# Altium project CAN_CurrentLoopModule.PrjPcb
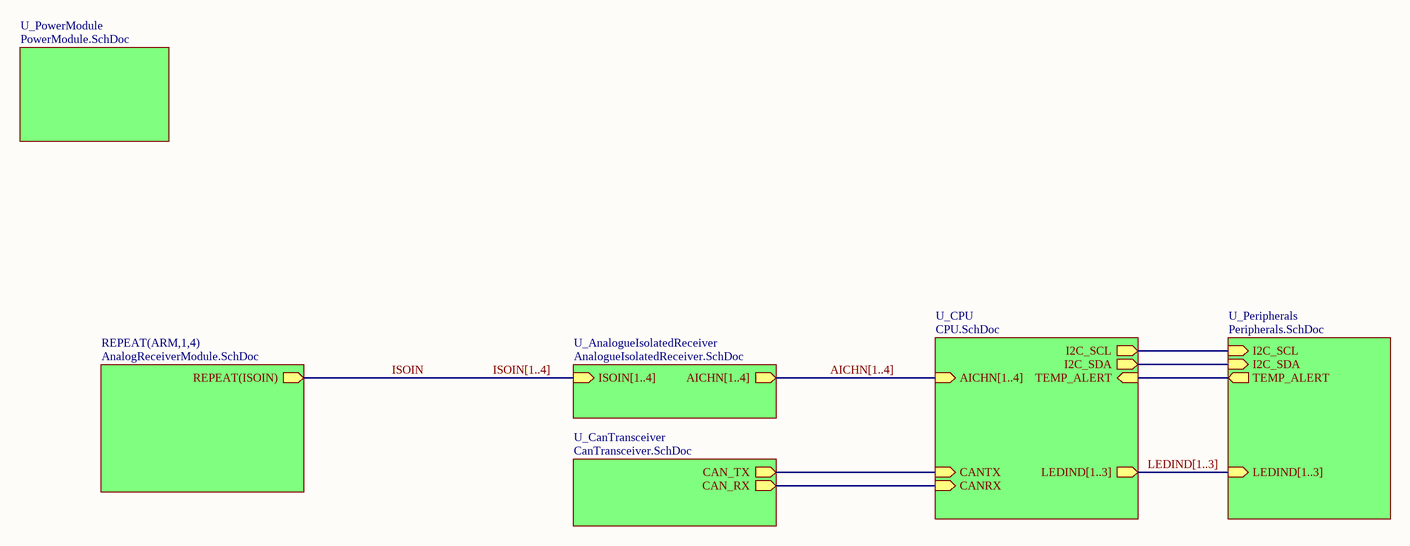
[diagram p0: TopSheet.SchDoc]
Address_Website: pablintino.com; EMail: me@pablintino.com; Project: AIC-ISO-C Module; VersionRevision: 1
7 sheets, 180 parts. Net scope: hierarchical (ports join the sheet entries above them; power ports are global).
Board file: AnalogIO-CAN-HW-Rev1.PcbDoc
Sheets:
  TopSheet.SchDoc
    U_PowerModule = PowerModule.SchDoc
    U_AnalogueIsolatedReceiver = AnalogueIsolatedReceiver.SchDoc
    U_CanTransceiver = CanTransceiver.SchDoc
    U_CPU = CPU.SchDoc
    U_Peripherals = Peripherals.SchDoc
    ARM1 = AnalogReceiverModule.SchDoc
    ARM2 = AnalogReceiverModule.SchDoc
    ARM3 = AnalogReceiverModule.SchDoc
    ARM4 = AnalogReceiverModule.SchDoc

## Sheet TopSheet.SchDoc
size A4

### Sub-sheets
REPEAT(ARM,1,4) = AnalogReceiverModule.SchDoc: REPEAT(ISOIN) (out)
U_AnalogueIsolatedReceiver = AnalogueIsolatedReceiver.SchDoc: ISOIN[1..4] (in), AICHN[1..4] (out)
U_CanTransceiver = CanTransceiver.SchDoc: CAN_RX (out), CAN_TX (out)
U_CPU = CPU.SchDoc: CANTX (in), CANRX (in), AICHN[1..4] (in), I2C_SCL (out), I2C_SDA (out), TEMP_ALERT (in), LEDIND[1..3] (out)
U_Peripherals = Peripherals.SchDoc: I2C_SCL (in), TEMP_ALERT (out), I2C_SDA (in), LEDIND[1..3] (in)
U_PowerModule = PowerModule.SchDoc: no entries

### Nets
I2C_SCL: sheet U_CPU/I2C_SCL, sheet U_Peripherals/I2C_SCL
I2C_SDA: sheet U_CPU/I2C_SDA, sheet U_Peripherals/I2C_SDA
ISOIN: sheet REPEAT(ARM,1,4)/REPEAT(ISOIN)
NetR33_2: sheet U_CPU/TEMP_ALERT, sheet U_Peripherals/TEMP_ALERT
NetU4_21: sheet U_CanTransceiver/CAN_RX, sheet U_CPU/CANRX
NetU4_22: sheet U_CanTransceiver/CAN_TX, sheet U_CPU/CANTX

### Buses and harness runs
bus AICHN[1..4] = sheet U_AnalogueIsolatedReceiver/AICHN[1..4] = sheet U_CPU/AICHN[1..4]
bus ISOIN[1..4] = sheet U_AnalogueIsolatedReceiver/ISOIN[1..4]
bus LEDIND[1..3] = sheet U_CPU/LEDIND[1..3] = sheet U_Peripherals/LEDIND[1..3]

### Notes on the sheet
- Title:
- Drawn By:
- Page Contents:
- Checked By:
- Size:
- Date:
- File:
- License:
- Email:
- A4
- Number:
- Time:
- Revision:
- Sheet
- Website:
- of

## Sheet PowerModule.SchDoc: CAN Current Loop Module - Power
size A4; Author: Pablo R Nava; DrawnBy: Pablo R Nava; Engineer: Pablo R Nava
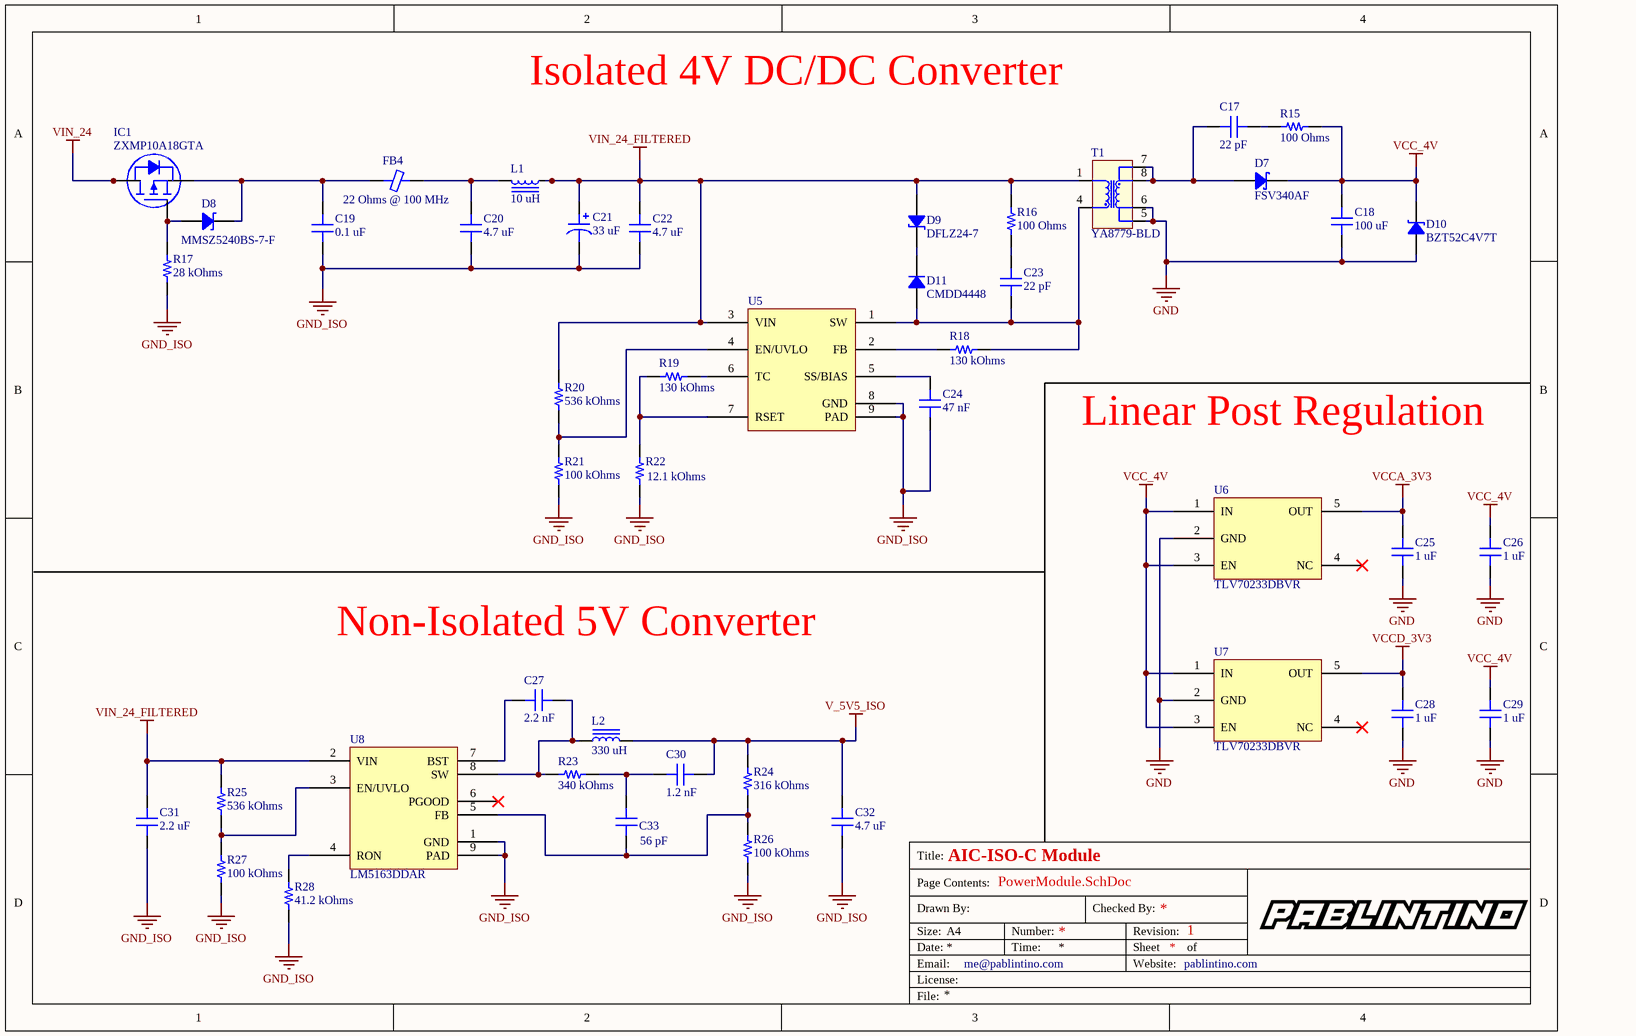
[diagram p1: PowerModule.SchDoc]

### Parts
(Parts that share a designator on the sheet are numbered #1, #2 ... from top to bottom, then left to right.)
C17#1  22 pF  [CAP 0805_2012]
C18  100 uF  [CAP 1210_3225 - 2.5MM]
C19  0.1 uF  [CAP 0805_2012]
C20  4.7 uF  [CAP 1210_3225 - 2.0MM]
C21  33 uF  [CAP ALSMD POLY 10.3MM H10.2MM]
C22  4.7 uF  [CAP 1210_3225 - 2.0MM]
C23  22 pF  [CAP 0805_2012]
C24  47 nF  [CAP 0805_2012]
C25  1 uF  [CAP 0805_2012]
C26  1 uF  [CAP 0805_2012]
C27  2.2 nF  [CAP 0805_2012]
C28  1 uF  [CAP 0805_2012]
C29  1 uF  [CAP 0805_2012]
C30  1.2 nF  [CAP 0805_2012]
C31  2.2 uF  [CAP 1210_3225 - 2.5MM]
C32  4.7 uF  [CAP 1210_3225 - 2.0MM]
C33  56 pF  [CAP 0805_2012]
D7  FSV340AF  [ON DO214AD SMAF]
D8  MMSZ5240BS-7-F  [SOD-123]
D9  DFLZ24-7  [POWERDI123]
D10  BZT52C4V7T  [SOD-523]
D11  CMDD4448  [SOD323]
FB4  22 Ohms @ 100 MHz  [FER 0805_2012]
IC1  ZXMP10A18GTA  [DIODES SOT-223]
L1  10 uH  [WE-TPC_4818]
L2  330 uH  [BOURNS SRR1280]
R15  100 Ohms  [RES 0805_2012]
R16  100 Ohms  [RES 0805_2012]
R17  28 kOhms  [RES 0805_2012]
R18  130 kOhms  [RES 0805_2012]
R19  130 kOhms  [RES 0805_2012]
R20  536 kOhms  [RES 0805_2012]
R21  100 kOhms  [RES 0805_2012]
R22  12.1 kOhms  [RES 0805_2012]
R23  340 kOhms  [RES 0805_2012]
R24  316 kOhms  [RES 0805_2012]
R25  536 kOhms  [RES 0805_2012]
R26  100 kOhms  [RES 0805_2012]
R27  100 kOhms  [RES 0805_2012]
R28  41.2 kOhms  [RES 0805_2012]
T1  YA8779-BLD  [YA8779]
U5  LM5180QNGURQ1  [TI WSON-8 NGU]  (value not drawn)
U6  TLV70233DBVR  [TI SOT-23-5 DBV]
U7  TLV70233DBVR  [TI SOT-23-5 DBV]
U8  LM5163DDAR  [SOIC_DDAR_TEX]

### Nets
GND: C18.2 C25.2 C26.2 C28.2 C29.2 D10.1 T1.5 T1.6 U6.2(GND) U7.2(GND)
GND_ISO: C19.2 C20.1 C21.2 C22.1 C24.1 C31.1 C32.1 R17.1 R21.1 R22.2 R26.2 R27.1 R28.2 U5.8(GND) U5.9(PAD) U8.1(GND) U8.9(PAD)
V_5V5_ISO: C30.1 C32.2 L2.2 R24.1
VCC_4V: C18.1 C26.1 C29.1 D7.2 D10.2 R15.1 U6.1(IN) U6.3(EN) U7.1(IN) U7.3(EN)
VCCA_3V3: C25.1 U6.5(OUT)
VCCD_3V3: C28.1 U7.5(OUT)
VIN_24: IC1.2(D) IC1.4(D)
VIN_24_FILTERED: C21.1 C22.2 C31.2 D9.1 L1.1 R16.2 R20.1 R25.1 T1.1 U5.3(VIN) U8.2(VIN)
NetC17#1_1: C17#1.1 D7.1 T1.7 T1.8
NetC17#1_2: C17#1.2 R15.2
NetC19_1: C19.1 D8.2 FB4.2 IC1.3(S)
NetC20_2: C20.2 FB4.1 L1.2
NetC23_1: C23.1 R16.1
NetC23_2: C23.2 D11.1 R18.1 T1.4 U5.1(SW)
NetC24_2: C24.2 U5.5(SS/BIAS)
NetC27_1: C27.1 L2.1 R23.2 U8.8(SW)
NetC27_2: C27.2 U8.7(BST)
NetC30_2: C30.2 C33.2 R23.1
NetC33_1: C33.1 R24.2 R26.1 U8.5(FB)
NetD8_1: D8.1 IC1.1(G) R17.2
NetD9_2: D9.2 D11.2
NetR18_2: R18.2 U5.2(FB)
NetR19_1: R19.1 U5.6(TC)
NetR19_2: R19.2 R22.1 U5.7(RSET)
NetR20_2: R20.2 R21.2 U5.4(EN/UVLO)
NetR25_2: R25.2 R27.2 U8.3(EN/UVLO)
NetR28_1: R28.1 U8.4(RON)

Not connected (* = marked no-connect by the designer): U6 4(NC)*; U7 4(NC)*; U8 6(PGOOD)*

### Notes on the sheet
- Isolated 4V DC/DC Converter
- Linear Post Regulation
- Non-Isolated 5V Converter
- Title:
- Drawn By:
- Page Contents:
- Checked By:
- Size:
- Date:
- File:
- License:
- Email:
- A4
- Number:
- Time:
- Revision:
- Sheet
- Website:
- of

### Library data of the parts
C17#1 C23 = 08051C220JAT2A: MLCC Ceramic 22 pF 100 V 5% Capacitor; Manufacturer: AVX; Voltage: 100 V; Type: capacitor_ceramic; Through Hole: 0; Part Number: 08051C220JAT2A; Value: 22 pF; Tolerance: 5%; Composition: X7R; Created On: 03/07/2020 16:35:00; Updated On: 03/07/2020 16:36:02; Package: 0805 (2012 Metric)
C18 = JMK325AC7107MM-P: MLCC Ceramic 100 uF 6.3 V 20% Capacitor; Manufacturer: Taiyo Yuden; Voltage: 6.3 V; Type: capacitor_ceramic; Through Hole: 0; Part Number: JMK325AC7107MM-P; Value: 100 uF; Tolerance: 20%; Composition: X7S; Created On: 03/07/2020 19:44:15; Updated On: 03/07/2020 19:44:30; Package: 1210 (3225 Metric)
C19 = 08051C104J4T4A: MLCC Ceramic 0.1 uF 100 V 10% Capacitor; Manufacturer: AVX; Voltage: 100 V; Type: capacitor_ceramic; Through Hole: 0; Part Number: 08051C104J4T4A; Value: 0.1 uF; Tolerance: 10%; Composition: X7R; Created On: 10/07/2020 23:21:56; Updated On: 10/07/2020 23:22:31; Package: 0805 (2012 Metric)
C20 C22 C32 = C3225X7S2A475M200AB: MLCC Ceramic 4.7 uF 100 V 20% Capacitor; Manufacturer: TDK; Voltage: 100 V; Type: capacitor_ceramic; Through Hole: 0; Part Number: C3225X7S2A475M200AB; Value: 4.7 uF; Tolerance: 20%; Composition: X7S; Created On: 10/07/2020 20:19:29; Updated On: 10/07/2020 20:19:45; Package: 1210 (3225 Metric)
C21 = EEEFK2A330P: Aluminum Electrolytic 33 uF 100 V 20% Capacitor; Manufacturer: Panasonic; Voltage: 100 V; Material: aluminium; Polarised: 1; ESR: 700 mOhms; Lifetime Temperature: 2000 Hours @ 105 ºC; Minimum Temperature: 105 ºC; Maximum Temperature: -55 ºC; Type: capacitor_electrolytic; Through Hole: 0; Part Number: EEEFK2A330P; Value: 33 uF; Tolerance: 20%; Created On: 08/07/2020 20:44:47; Updated On: 08/07/2020 21:47:25; Package: SMD
C24 = C2012X7R2A473K125AA: MLCC Ceramic 47 nF 100 V 10% Capacitor; Manufacturer: TDK; Voltage: 200 V; Type: capacitor_ceramic; Through Hole: 0; Part Number: C2012X7R2A473K125AA; Value: 47 nF; Tolerance: 10%; Composition: X7R; Created On: 31/05/2020 9:04:57; Updated On: 31/05/2020 9:07:12; Package: 0805 (2012 Metric)
C25 C26 C28 C29 = 0805YC105KAT4A: MLCC Ceramic 1 uF 16 V 10% Capacitor; Manufacturer: AVX; Voltage: 16 V; Type: capacitor_ceramic; Through Hole: 0; Part Number: 0805YC105KAT4A; Value: 1 uF; Tolerance: 10%; Composition: X7R; Created On: 18/07/2020 20:46:26; Updated On: 18/07/2020 20:46:47; Package: 0805 (2012 Metric)
C27 = C0805C222K5RACTU: MLCC Ceramic 2.2 nF 50 V 10% Capacitor; Manufacturer: KEMET; Voltage: 50 V; Type: capacitor_ceramic; Through Hole: 0; Part Number: C0805C222K5RACTU; Value: 2.2 nF; Tolerance: 10%; Composition: X7R; Created On: 16/07/2020 19:02:56; Updated On: 16/07/2020 19:04:14; Package: 0805 (2012 Metric)
C30 = 08055C122KAT2A: MLCC Ceramic 1.2 nF 50 V 10% Capacitor; Manufacturer: AVX; Voltage: 50 V; Type: capacitor_ceramic; Through Hole: 0; Part Number: 08055C122KAT2A; Value: 1.2 nF; Tolerance: 10%; Composition: X7R; Created On: 16/07/2020 19:09:00; Updated On: 16/07/2020 19:09:07; Package: 0805 (2012 Metric)
C31 = C3225X7R2A225K230AB: MLCC Ceramic 2.2 uF 100 V 10% Capacitor; Manufacturer: TDK; Voltage: 100 V; Type: capacitor_ceramic; Through Hole: 0; Part Number: C3225X7R2A225K230AB; Value: 2.2 uF; Tolerance: 10%; Composition: X7R; Created On: 20/07/2020 23:03:57; Updated On: 20/07/2020 23:04:45; Package: 1210 (3225 Metric)
C33 = 08055A560JAT2A: MLCC Ceramic 56 pF 50 V 5% Capacitor; Manufacturer: AVX; Tolerance: 10%; Voltage: 50 V; Type: capacitor_ceramic; Through Hole: 0; Part Number: 08055A560JAT2A; Value: 56 pF; Composition: NP0; Created On: 16/07/2020 19:36:43; Updated On: 16/07/2020 19:36:54; Package: 0805 (2012 Metric)
D7 = FSV340AF: Schottky Diode; Manufacturer: ON Semiconductor; Forward Voltage: 0.5 V; Reverse Leakage Current: 100 uA; Maximum Forward Avg. Current: 3 A; Maximum Repetitive Reverse Voltage: 40 V; Type: diode_rectifier; Through Hole: 0; Part Number: FSV340AF; Diode Type: schottky; Created On: 30/06/2020 19:58:51; Updated On: 30/06/2020 20:11:25; Package: DO-214AD
D8 = MMSZ5240BS-7-F: Zener 200 mW 10 V; Manufacturer: Diodes Incorporated; Maximum Power: 200 mW; Forward Voltage: 0.9 V; Zener Voltage: 10 V; Type: diode_zener; Through Hole: 0; Part Number: MMSZ5240BS-7-F; Created On: 19/07/2020 12:49:44; Updated On: 19/07/2020 13:00:21; Package: SOD-323-2
D9 = DFLZ24-7: Power Zener 1 W 24 V; Manufacturer: Diodes Incorporated; Maximum Power: 1 W; Forward Voltage: 24 V; Type: diode_zener; Through Hole: 0; Part Number: DFLZ24-7; Created On: 30/06/2020 21:18:03; Updated On: 30/06/2020 21:18:48; Package: PowerDI 123-2
D10 = BZT52C4V7T: Zener 300 mW 4.7 V; Part Number: BZT52C4V7T
D11 = CMDD4448: High Speed Silicon Switching Diode; Manufacturer: Central Semiconductor Corp.; Forward Voltage: 1 V; Reverse Leakage Current: 25 nA; Maximum Forward Avg. Current: 250 mA; Maximum Repetitive Reverse Voltage: 100 V; Diode Type: rectifier; Type: diode_rectifier; Through Hole: 0; Part Number: CMDD4448; Created On: 02/07/2020 19:02:22; Updated On: 02/07/2020 19:05:20; Package: SOD-323
FB4 = 742792021: Ferrite bead 22 Ohms @ 100 MHz; Manufacturer: Würth Electronik; Number of Lines: 1; DC Resistance: 8 mOhms; Current Rating: 6 A; Type: ferrite_bead; Through Hole: 0; Part Number: 742792021; Value: 22 Ohms @ 100 MHz; Impedance Frequency: 22 Ohms @ 100 MHz; Created On: 10/07/2020 22:54:16; Updated On: 10/07/2020 23:17:54; Package: 0805 (2012 Metric)
IC1 = ZXMP10A18GTA: MOSFET 100V P-Chnl UMOS; Manufacturer: Diodes Incorporated; Drain Source Resistance: 150 mOhms; Gate Source Max Voltage: 20 V; Gate Source Threshold Voltage: 2 V; Drain Source Max Current: 3.7 A; Maximum Power: 3.9 W; Channel Type: P-Channel; Through Hole: 0; Part Number: ZXMP10A18GTA; Drain Source Max Voltage: 100 V; Created On: 19/07/2020 8:37:51; Updated On: 19/07/2020 11:20:23; Type: transistor_mosfet; Package: SOT-223-4
L1 = 744042100: Tinny Power Inductor 10 uH 1.3 A; Manufacturer: Würth Electronik; Resistance DCR: 120 mOhms; Test Frequency: 100 kHz; Current Rating: 1.3 A; Current Saturation: 1 A; Tolerance: 30%; Type: power_inductor; Through Hole: 0; Part Number: 744042100; Value: 10 uH; Created On: 10/07/2020 20:04:38; Updated On: 10/07/2020 20:09:18; Package: ACT45B
L2 = SRR1208-331KL: Shielded Power Inductor 330 uH 0.85 A; Manufacturer: Bourns; Resistance DCR: 650 mOhms; Test Frequency: 0.796 MHz; Current Rating: 0.85 A; Current Saturation: 1.12 A; Tolerance: 10%; Type: power_inductor; Through Hole: 0; Part Number: SRR1208-331KL; Value: 330 uH; Created On: 13/07/2020 19:41:55; Updated On: 13/07/2020 19:43:17; Package: SRR1280
R15 R16 = CRCW0805100RFKEAC: Thin Film Resistor 100 Ohms 1%; Manufacturer: Vishay / Dale; Power Max: 125 mW; Through Hole: 0; Part Number: CRCW0805100RFKEAC; Value: 100 Ohms; Tolerance: 1%; Created On: 16/05/2020 11:51:25; Updated On: 16/05/2020 13:13:19; Type: resistor; Package: 0805 (2012 Metric)
R17 = CRCW080528K0FKEA: Thin Film Resistor 28 kOhms 1%; Manufacturer: Vishay / Dale; Power Max: 125 mW; Through Hole: 0; Part Number: CRCW080528K0FKEA; Value: 28 kOhms; Tolerance: 1%; Created On: 19/07/2020 13:06:42; Updated On: 19/07/2020 13:07:02; Type: resistor; Package: 0805 (2012 Metric)
R18 R19 = CRCW0805130KFKEAC: Thin Film Resistor 130 kOhms 1%; Manufacturer: Vishay / Dale; Power Max: 125 mW; Through Hole: 0; Part Number: CRCW0805130KFKEAC; Value: 130 kOhms; Tolerance: 1%; Created On: 09/07/2020 18:08:17; Updated On: 09/07/2020 18:08:28; Type: resistor; Package: 0805 (2012 Metric)
R20 R25 = CRCW0805536KFKEA: Thin Film Resistor 536 kOhms 1%; Manufacturer: Vishay / Dale; Power Max: 125 mW; Through Hole: 0; Part Number: CRCW0805536KFKEA; Value: 536 kOhms; Tolerance: 1%; Created On: 09/07/2020 18:04:35; Updated On: 09/07/2020 18:04:45; Type: resistor; Package: 0805 (2012 Metric)
R21 R26 R27 = CRCW0805100KFKEAC: Thin Film Resistor 100 kOhms 1%; Manufacturer: Vishay / Dale; Power Max: 125 mW; Through Hole: 0; Part Number: CRCW0805100KFKEAC; Value: 100 kOhms; Tolerance: 1%; Created On: 09/07/2020 18:07:58; Updated On: 09/07/2020 18:08:25; Type: resistor; Package: 0805 (2012 Metric)
R22 = CRCW080512K1FKEA: Thin Film Resistor 12.1 kOhms 1%; Manufacturer: Vishay / Dale; Power Max: 125 mW; Through Hole: 0; Part Number: CRCW080512K1FKEA; Value: 12.1 kOhms; Tolerance: 1%; Created On: 09/07/2020 18:06:27; Updated On: 09/07/2020 18:06:42; Type: resistor; Package: 0805 (2012 Metric)
R23 = CRCW0805340KFKEAC: Thin Film Resistor 340 kOhms 1%; Manufacturer: Vishay / Dale; Power Max: 125 mW; Through Hole: 0; Part Number: CRCW0805340KFKEAC; Value: 340 kOhms; Tolerance: 1%; Created On: 16/07/2020 18:43:47; Updated On: 16/07/2020 18:45:23; Type: resistor; Package: 0805 (2012 Metric)
R24 = CRCW0805316KFKEAC: Thin Film Resistor 316 kOhms 1%; Manufacturer: Vishay / Dale; Power Max: 125 mW; Through Hole: 0; Part Number: CRCW0805316KFKEAC; Value: 316 kOhms; Tolerance: 1%; Created On: 16/07/2020 18:47:45; Updated On: 16/07/2020 18:48:00; Type: resistor; Package: 0805 (2012 Metric)
R28 = CRCW080541K2FKEAC: Thin Film Resistor 41.2 kOhms 1%; Manufacturer: Vishay / Dale; Power Max: 125 mW; Through Hole: 0; Part Number: CRCW080541K2FKEAC; Value: 41.2 kOhms; Tolerance: 1%; Created On: 16/07/2020 18:51:09; Updated On: 16/07/2020 18:51:15; Type: resistor; Package: 0805 (2012 Metric)
T1 = YA8779-BLD: YA8779 Flyback Transformer; Manufacturer: Coilcraft; Number of Windings: 2; Primary DCR: 0.140 Ohms; Secondary DCR: 0.013 Ohms; Current Rating: 0.380 uH; Primary Inductance: 30 uH; Secondary Current Rating: 1.2 A; Primary Voltage Rating: 70 V; Secondary Voltage Rating: 5 V; NPS Turns Ratio: 1:0.330; Through Hole: 0; Part Number: YA8779-BLD; Created On: 24/06/2020 22:00:46; Updated On: 29/06/2020 22:52:20; Type: transformer; Package: YA8779
U5 = LM5180QNGURQ1: 65-V IN PSR Flyback DC/DC Converter with 100-V, 1.5-A Integrated Power MOSFET; Part Number: LM5180QNGURQ1
U6 U7 = TLV70233DBVR: TLV702 300-mA, Low-IQ, Low-Dropout Regulator; Part Number: TLV70233DBVR
U8 = LM5163DDAR: 100-V Input, 0.5-A Synchronous Buck DC/DC Converter with Ultra-low IQ; Manufacturer: Texas Instruments; Minimum Input Voltage: 6 V; Maximum Output Voltage: 100 V; Output Current: 0.5 A; Switching Frequency: 1 MHz; Output Type: TBD; Number of Outputs: 1; Through Hole: 0; Part Number: LM5163DDAR; Topology: buck; Created On: 13/07/2020 20:55:36; Updated On: 13/07/2020 20:57:00; Type: voltage_regulator_dcdc; Package: PowerPAD-8

## Sheet AnalogueIsolatedReceiver.SchDoc
size A4; Author: Pablo R Nava; DrawnBy: Pablo R Nava; Engineer: Pablo R Nava
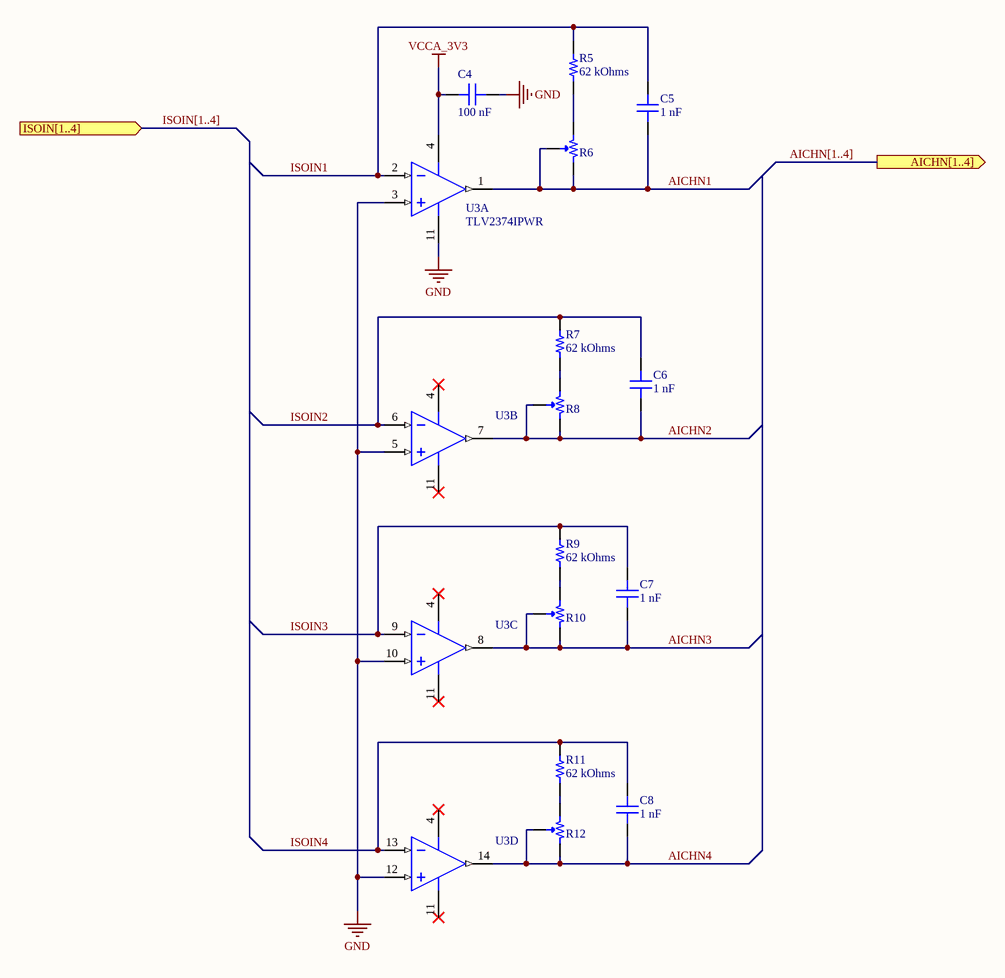
[diagram p2: AnalogueIsolatedReceiver.SchDoc]

### Parts
C4  100 nF  [CAP 0603_1608]
C5  1 nF  [CAP 0603_1608]
C6  1 nF  [CAP 0603_1608]
C7  1 nF  [CAP 0603_1608]
C8  1 nF  [CAP 0603_1608]
R5  62 kOhms  [RES 0603_1608]
R6  10 kOhms  [POT BOURNS TRIMPOT 3224W]  (value not drawn)
R7  62 kOhms  [RES 0603_1608]
R8  10 kOhms  [POT BOURNS TRIMPOT 3224W]  (value not drawn)
R9  62 kOhms  [RES 0603_1608]
R10  10 kOhms  [POT BOURNS TRIMPOT 3224W]  (value not drawn)
R11  62 kOhms  [RES 0603_1608]
R12  10 kOhms  [POT BOURNS TRIMPOT 3224W]  (value not drawn)
U3  TLV2374IPWR  [TI TSSOP-14 PW]  (parts A,B,C,D of 4)

### Ports
AICHN[1..4] (out), ISOIN[1..4] (in)

### Nets
GND: C4.1 U3.3(IN1+) U3.5(IN2+) U3.10(IN3+) U3.11(GND) U3.12(IN4+)
VCCA_3V3: C4.2 U3.4(VDD)
AICHN1: C5.2 R6.2 R6.3 U3.1(OUT1)
AICHN2: C6.2 R8.2 R8.3 U3.7(OUT2)
AICHN3: C7.2 R10.2 R10.3 U3.8(OUT3)
AICHN4: C8.2 R12.2 R12.3 U3.14(OUT4)
ISOIN1: C5.1 R5.2 U3.2(IN1-)  [project net ISOIN]
ISOIN2: C6.1 R7.2 U3.6(IN2-)  [project net ISOIN]
ISOIN3: C7.1 R9.2 U3.9(IN3-)  [project net ISOIN]
ISOIN4: C8.1 R11.2 U3.13(IN4-)  [project net ISOIN]
NetR5_1: R5.1 R6.1
NetR7_1: R7.1 R8.1
NetR9_1: R9.1 R10.1
NetR11_1: R11.1 R12.1

### Buses and harness runs
bus AICHN[1..4] = port AICHN[1..4]
bus ISOIN[1..4] = port ISOIN[1..4]

### Notes on the sheet
- Title:
- Drawn By:
- Page Contents:
- Checked By:
- Size:
- Date:
- File:
- License:
- Email:
- A4
- Number:
- Time:
- Revision:
- Sheet
- Website:
- of

### Library data of the parts
C4 = 0603YC104KAT2A: MLCC Ceramic 100 nF 16 V 10% Capacitor; Manufacturer: AVX; Voltage: 16 V; Type: capacitor_ceramic; Through Hole: 0; Part Number: 0603YC104KAT2A; Value: 100 nF; Tolerance: 10%; Composition: X7R; Created On: 22/07/2020 19:09:12; Updated On: 22/07/2020 19:10:15; Package: 0603 (1608 Metric)
C5-C8 = 0603ZA102JAT4A: MLCC Ceramic 1 nF 10 V 5% Capacitor; Manufacturer: AVX; Voltage: 10 V; Type: capacitor_ceramic; Through Hole: 0; Part Number: 0603ZA102JAT4A; Value: 1 nF; Tolerance: 5%; Composition: NP0; Created On: 04/08/2020 17:52:12; Updated On: 04/08/2020 17:52:29; Package: 0603 (1608 Metric)
R5 R7 R9 R11 = CRCW060362K0FKEAC: Thin Film Resistor 62 kOhms 1%; Manufacturer: Vishay / Dale; Power Max: 100 mW; Through Hole: 0; Part Number: CRCW060362K0FKEAC; Value: 62 kOhms; Tolerance: 1%; Created On: 04/08/2020 17:41:08; Updated On: 04/08/2020 17:41:38; Type: resistor; Package: 0603 (1608 Metric)
R6 R8 R10 R12 = 3224W-1-103G: Inline Multitourn 10 kOhms 10% potentiometer; Manufacturer: Bourns; Maximum Power: 250 mW; Minimum Resistance: 0 Ohms; Number of Turns: 12; Through Hole: 0; Part Number: 3224W-1-103G; Value: 10 kOhms; Tolerance: 10%; Maximum Resistance: 10 kOhms; Created On: 04/08/2020 17:43:15; Updated On: 04/08/2020 17:43:43; Type: potentiometer; Package: 3224W
U3 = TLV2374IPWR: TLV2374 Rail-to-Rail I/O Opamp; Manufacturer: Texas Instruments; Gain Bandwith Product: 3 MHz; Amplifier Type: 125 mW; Slew Rate: 2.4 V/us; Voltage Supplies: 2.7-16 V; Input Offset Voltage: 2 mV; Output Current: 100 mA; Through Hole: 0; Part Number: TLV2374IPWR; Output Type: Rail-to-Rail; Input Type: Rail-to-Rail; Created On: 04/08/2020 17:15:07; Updated On: 04/08/2020 17:19:26; Type: opamp; Package: TSSOP-14

## Sheet CanTransceiver.SchDoc
size A4; Author: Pablo R Nava; DrawnBy: Pablo R Nava; Engineer: Pablo R Nava
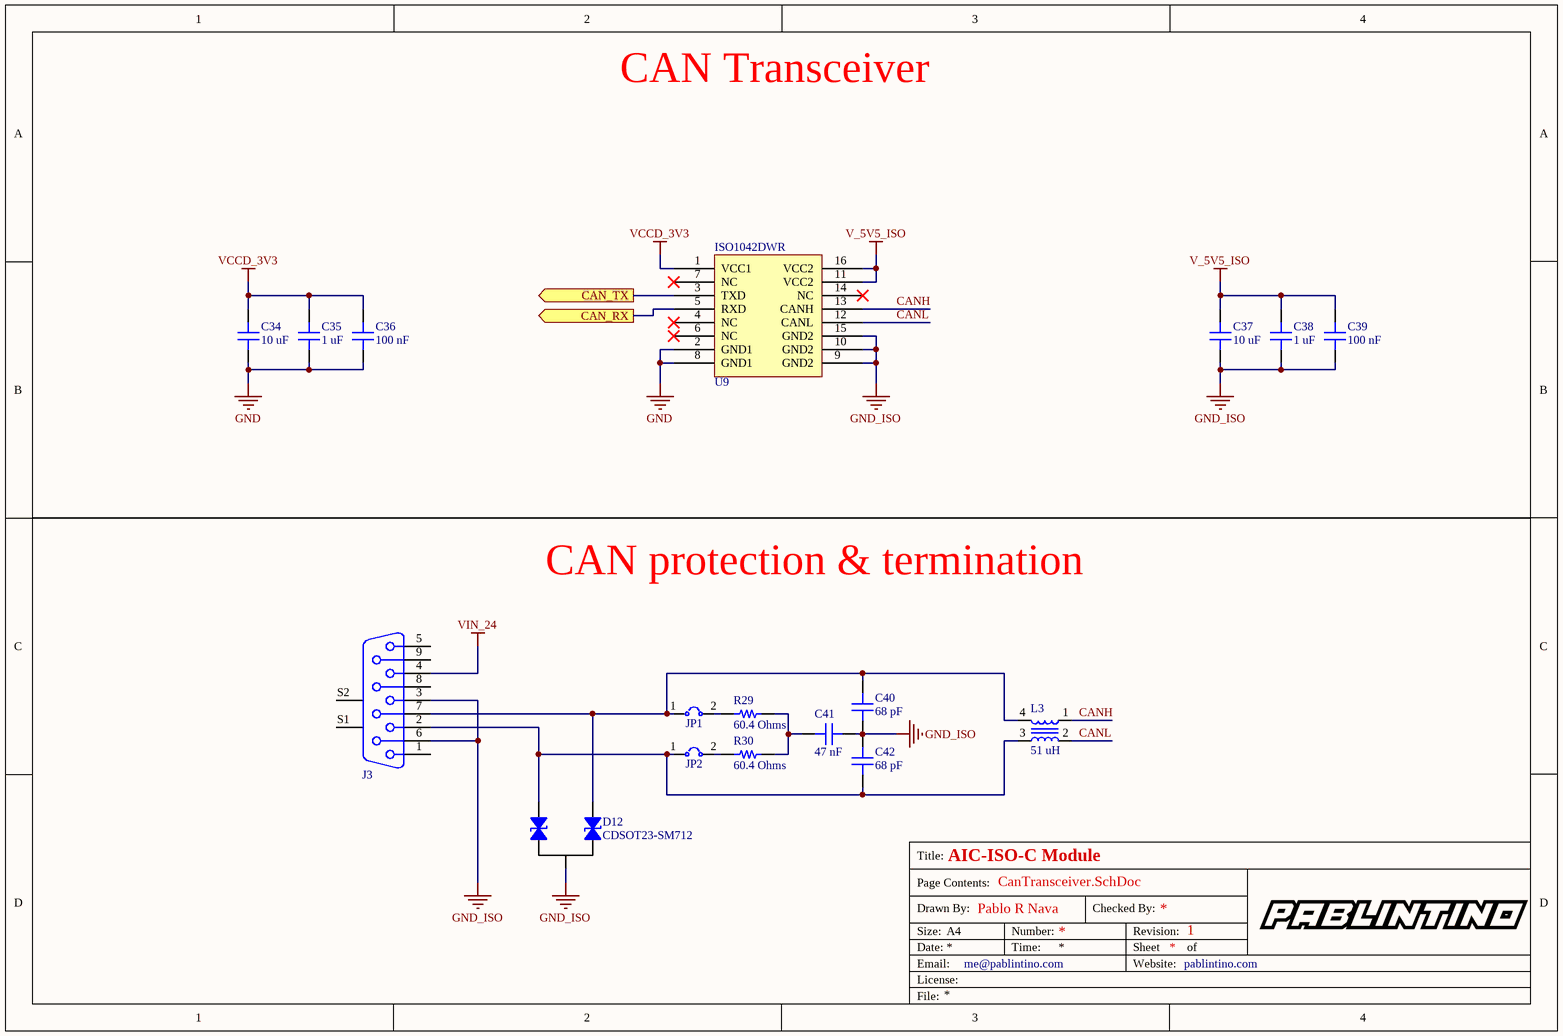
[diagram p3: CanTransceiver.SchDoc]

### Parts
C34  10 uF  [CAP 0805_2012]
C35  1 uF  [CAP 0603_1608]
C36  100 nF  [CAP 0603_1608]
C37  10 uF  [CAP 0805_2012]
C38  1 uF  [CAP 0603_1608]
C39  100 nF  [CAP 0603_1608]
C40  68 pF  [CAP 0603_1608]
C41  47 nF  [CAP 0805_2012]
C42  68 pF  [CAP 0603_1608]
D12  CDSOT23-SM712  [BOURNS SOT-23-3]
J3  09681537613  [DSUB9]  (value not drawn)
JP1  61300211121  [JUMPER-100]  (value not drawn)
JP2  61300211121  [JUMPER-100]  (value not drawn)
L3  51 uH  [TDK_ACT45B]
R29  60.4 Ohms  [RES 0805_2012]
R30  60.4 Ohms  [RES 0805_2012]
U9  ISO1042DWR  [TI-DW16_N]

### Ports
CAN_RX (out), CAN_TX (out)

### Nets
GND: C34.2 C35.1 C36.2 U9.2(GND1) U9.8(GND1)
GND_ISO: C37.2 C38.1 C39.2 C40.2 C41.1 C42.1 D12.3 J3.3 J3.6 U9.9(GND2) U9.10(GND2) U9.15(GND2)
V_5V5_ISO: C37.1 C38.2 C39.1 U9.11(VCC2) U9.16(VCC2)
VCCD_3V3: C34.1 C35.2 C36.1 U9.1(VCC1)
VIN_24: J3.4
CANH: L3.1 U9.13(CANH)
CANL: L3.2 U9.12(CANL)
NetC40_1: C40.1 D12.2 J3.7 JP1.1(A) L3.4
NetC41_2: C41.2 R29.1 R30.1
NetC42_2: C42.2 D12.1 J3.2 JP2.1(A) L3.3
NetJP1_2: JP1.2(K) R29.2
NetJP2_2: JP2.2(K) R30.2
NetU4_21: U9.5(RXD) ; port CAN_RX
NetU4_22: U9.3(TXD) ; port CAN_TX

Not connected (* = marked no-connect by the designer): J3 1 5 8 9 S1 S2; U9 4(NC)* 6(NC)* 7(NC)* 14(NC)*

### Notes on the sheet
- CAN Transceiver
- CAN protection & termination
- Title:
- Drawn By:
- Page Contents:
- Checked By:
- Size:
- Date:
- File:
- License:
- Email:
- A4
- Number:
- Time:
- Revision:
- Sheet
- Website:
- of

### Library data of the parts
C34 C37 = 0805YC106MAT2A: MLCC Ceramic 10 uF 25 V 20% Capacitor; Manufacturer: AVX; Voltage: 16 V; Type: capacitor_ceramic; Through Hole: 0; Part Number: 0805YC106MAT2A; Value: 10 uF; Tolerance: 20%; Composition: X7R; Created On: 22/06/2020 21:37:18; Updated On: 22/06/2020 21:37:31; Package: 0805 (2012 Metric)
C35 C38 = 06033C105KAT4A: MLCC Ceramic 1 uF 25 V 10% Capacitor; Manufacturer: AVX; Voltage: 25 V; Type: capacitor_ceramic; Through Hole: 0; Part Number: 06033C105KAT4A; Value: 1 uF; Tolerance: 10%; Composition: X7R; Created On: 22/06/2020 21:33:54; Updated On: 22/06/2020 21:34:12; Package: 0603 (1608 Metric)
C36 C39 = 06035C104K4Z2A: MLCC Ceramic 100 nF 50 V 10% Capacitor; Manufacturer: AVX; Voltage: 50 V; Type: capacitor_ceramic; Through Hole: 0; Part Number: 06035C104K4Z2A; Value: 100 nF; Tolerance: 10%; Composition: X7R; Created On: 22/06/2020 21:28:51; Updated On: 22/06/2020 21:29:02; Package: 0603 (1608 Metric)
C40 C42 = 06031U680GAT2A: MLCC Ceramic 68 pF 100 V 2% Capacitor; Manufacturer: AVX; Voltage: 100 V; Type: capacitor_ceramic; Through Hole: 0; Part Number: 06031U680GAT2A; Value: 68 pF; Tolerance: 2%; Composition: NP0; Created On: 23/06/2020 20:31:11; Updated On: 23/06/2020 20:32:22; Package: 0603 (1608 Metric)
C41 = C2012X7R2A473K125AA: as C24 on sheet PowerModule; Part Number: C2012X7R2A473K125AA; Value: 47 nF; Tolerance: 10%; Composition: X7R; Created On: 31/05/2020 9:04:57; Updated On: 31/05/2020 9:07:12; Package: 0805 (2012 Metric)
D12 = CDSOT23-SM712: CAN bus TVS diode; Manufacturer: Bourns; Standoff Reverse Voltage: 13.3 V; Minimum Breakdown Voltage: 12 V; Maximum Clamping Voltage: 26 V; Type: diode_tvs; Through Hole: 0; Part Number: CDSOT23-SM712; Created On: 22/06/2020 21:57:13; Updated On: 22/06/2020 21:57:43; Package: SOT-23
J3 = 09681537613: DSUB SV FE SSDP ANG-US 09P AU3; Manufacturer: Harting; Pitch: 2.77 mm; Current Rating: 6 A; Number of Contacts: 9; Through Hole: 1; Part Number: 09681537613; Orientation: right; Number of Rows: 2; Created On: 18/07/2020 11:53:48; Updated On: 18/07/2020 11:54:47; Type: connector_pcb; Package: Through Hole
JP1 JP2 = 61300211121: Connector Header Through Hole 2 position 0.100 (2.54mm); Manufacturer: Würth Elektronik; Pitch: 100 mil; Voltage Rating: 250 V; Current Rating: 3 A; Number of Contacts: 2; Through Hole: 1; Part Number: 61300211121; Orientation: straight; Number of Rows: 1; Created On: 19/07/2020 13:40:52; Updated On: 19/07/2020 13:41:17; Type: connector_pcb; Package: Through Hole
L3 = ACT45B-510-2P-TL003: CAN Bus Common Choke; Manufacturer: TDK; Number of Lines: 2; DC Resistance: 1 Ohms; Impedance Frequency: 2800 Ohms @ 10 MHz; Current Rating: 200 mA; Type: inductor_choke; Through Hole: 0; Part Number: ACT45B-510-2P-TL003; Value: 51 uH; Created On: 23/06/2020 19:40:24; Updated On: 23/06/2020 20:05:36; Package: ACT45B
R29 R30 = CRCW080560R4FKEA: Thin Film Resistor 60.4 Ohms 1%; Manufacturer: Vishay / Dale; Power Max: 125 mW; Through Hole: 0; Part Number: CRCW080560R4FKEA; Value: 60.4 Ohms; Tolerance: 1%; Created On: 19/05/2020 17:44:54; Updated On: 19/05/2020 17:46:42; Type: resistor; Package: 0805 (2012 Metric)
U9 = ISO1042DWR: Isolated CAN FD Transceiver; Manufacturer: Texas Instruments; Duplex: Full-Duplex; Data Rate: 5Mbps; Supply Voltage: 5 V; Through Hole: 0; Part Number: ISO1042DWR; Protocol: CAN; Created On: 22/06/2020 19:10:03; Updated On: 22/06/2020 19:54:36; Type: transceiver; Package: SOIC-16

## Sheet CPU.SchDoc
size A4
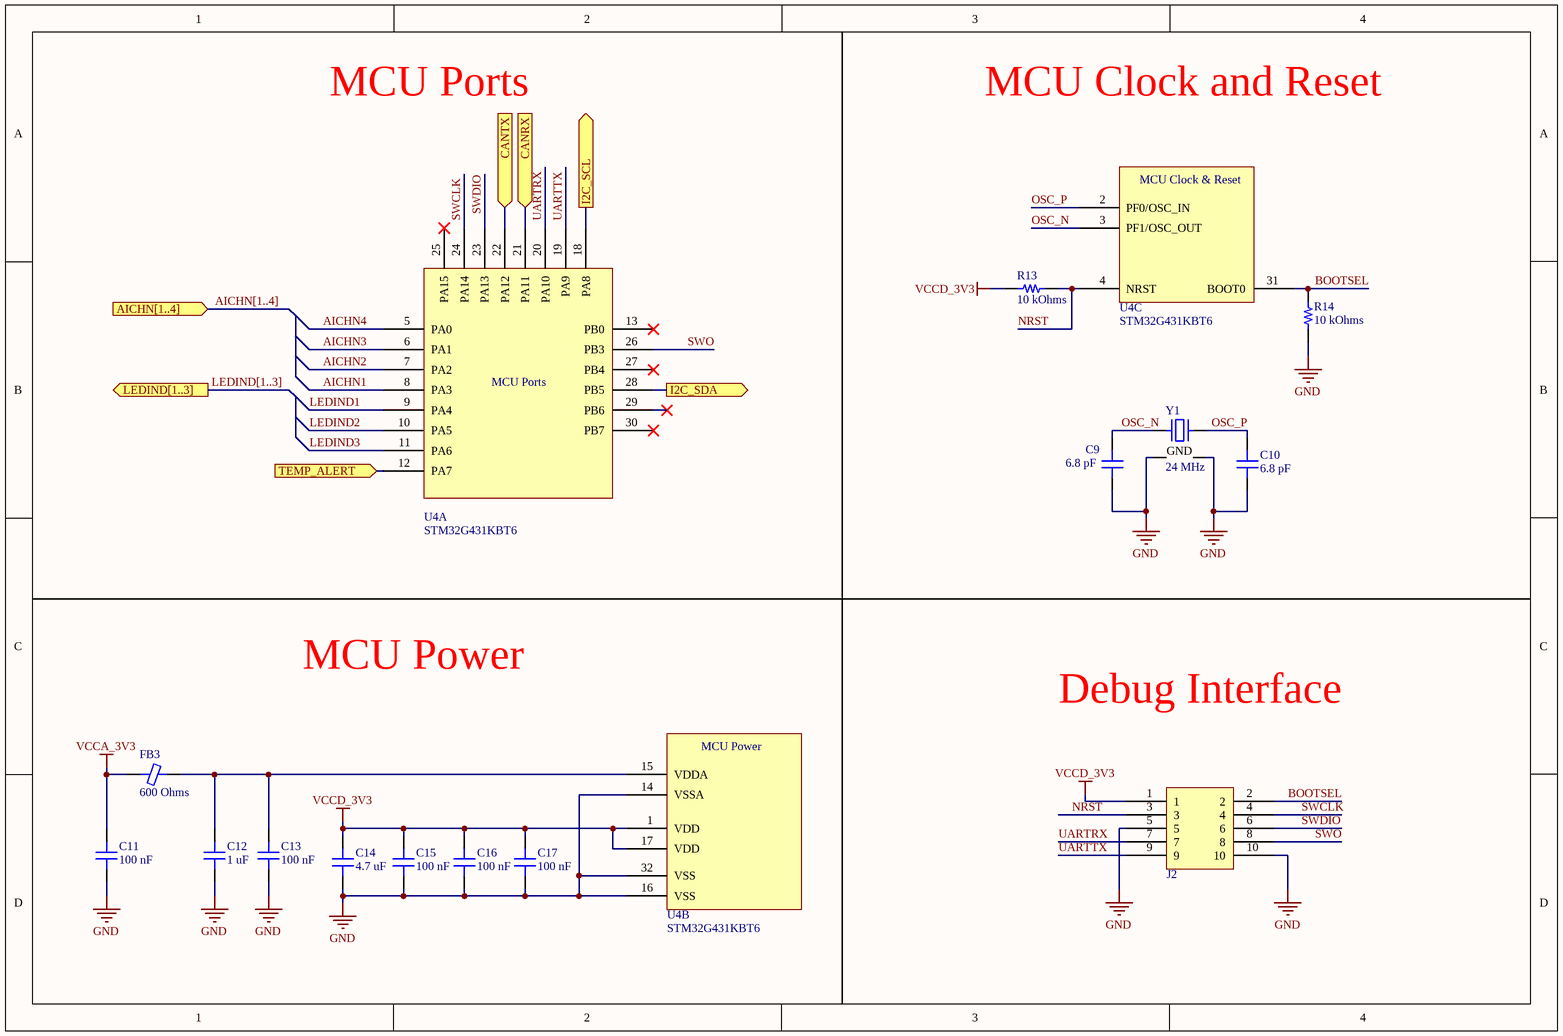
[diagram p4: CPU.SchDoc]

### Parts
(Parts that share a designator on the sheet are numbered #1, #2 ... from top to bottom, then left to right.)
C9  6.8 pF  [CAP 0603_1608]
C10  6.8 pF  [CAP 0603_1608]
C11  100 nF  [CAP 0603_1608]
C12  1 uF  [CAP 0603_1608]
C13  100 nF  [CAP 0603_1608]
C14  4.7 uF  [CAP 0603_1608]
C15  100 nF  [CAP 0603_1608]
C16  100 nF  [CAP 0603_1608]
C17#2  100 nF  [CAP 0603_1608]
FB3  600 Ohms  [FER 0805_2012]
J2  SHF-105-01-L-D-TH  [SHF-105-01-X-D-TH]  (value not drawn)
R13  10 kOhms  [RES 0603_1608]
R14  10 kOhms  [RES 0603_1608]
U4  STM32G431KBT6  [LQFP32ST]  (parts A,B,C of 3)
Y1  24 MHz  [ABM8G]

### Ports
AICHN[1..4] (in), CANRX (in), CANTX (in), I2C_SCL (out), I2C_SDA (out), LEDIND[1..3] (out), TEMP_ALERT (in)

### Nets
GND: C9.2 C10.2 C11.2 C12.1 C13.2 C14.1 C15.2 C16.2 C17#2.2 J2.5 J2.10 R14.2 U4.14(VSSA) U4.16(VSS) U4.32(VSS) Y1.2(GND) Y1.4(GND)
VCCA_3V3: C11.1 FB3.2
VCCD_3V3: C14.2 C15.1 C16.1 C17#2.1 J2.1 R13.1 U4.1(VDD) U4.17(VDD)
AICHN1: U4.8(PA3)
AICHN2: U4.7(PA2)
AICHN3: U4.6(PA1)
AICHN4: U4.5(PA0)
BOOTSEL: J2.2 R14.1 U4.31(BOOT0)
I2C_SCL: U4.18(PA8) ; port I2C_SCL
I2C_SDA: U4.28(PB5) ; port I2C_SDA
LEDIND1: U4.9(PA4)
LEDIND2: U4.10(PA5)
LEDIND3: U4.11(PA6)
NRST: J2.3 R13.2 U4.4(NRST)
OSC_N: C9.1 U4.3(PF1/OSC_OUT) Y1.1
OSC_P: C10.1 U4.2(PF0/OSC_IN) Y1.3
SWCLK: J2.4 U4.24(PA14)
SWDIO: J2.6 U4.23(PA13)
SWO: J2.8 U4.26(PB3)
UARTRX: J2.7 U4.20(PA10)
UARTTX: J2.9 U4.19(PA9)
NetC12_2: C12.2 C13.1 FB3.1 U4.15(VDDA)
NetR33_2: U4.12(PA7) ; port TEMP_ALERT
NetU4_21: U4.21(PA11) ; port CANRX
NetU4_22: U4.22(PA12) ; port CANTX

Not connected (* = marked no-connect by the designer): U4 13(PB0)* 25(PA15)* 27(PB4)* 29(PB6)* 30(PB7)*

### Buses and harness runs
bus AICHN[1..4] = port AICHN[1..4]
bus LEDIND[1..3] = port LEDIND[1..3]

### Notes on the sheet
- MCU Ports
- MCU Clock and Reset
- MCU Power
- Debug Interface
- Title:
- Drawn By:
- Page Contents:
- Checked By:
- Size:
- Date:
- File:
- License:
- Email:
- A4
- Number:
- Time:
- Revision:
- Sheet
- Website:
- of
- (in symbol STM32G431KBT6, part A) MCU Ports
- (in symbol STM32G431KBT6, part B) MCU Power
- (in symbol STM32G431KBT6, part C) MCU Clock & Reset

### Library data of the parts
C9 C10 = 06035A6R8C4T4A: MLCC Ceramic 6.8 pF 50 V 0.25 pF Capacitor; Manufacturer: AVX; Tolerance: 0.25 pF; Voltage: 50 V; Type: capacitor_ceramic; Through Hole: 0; Part Number: 06035A6R8C4T4A; Value: 6.8 pF; Composition: NP0; Created On: 26/07/2020 23:31:19; Updated On: 26/07/2020 23:32:14; Package: 0603 (1608 Metric)
C11 C13 C15 C16 C17#2 = 0603YC104KAT2A: as C4 on sheet AnalogueIsolatedReceiver; Part Number: 0603YC104KAT2A; Value: 100 nF; Tolerance: 10%; Composition: X7R; Created On: 22/07/2020 19:09:12; Updated On: 22/07/2020 19:10:15; Package: 0603 (1608 Metric)
C12 = 0603YC105KAT2A: MLCC Ceramic 1 uF 16 V 10% Capacitor; Manufacturer: AVX; Voltage: 16 V; Type: capacitor_ceramic; Through Hole: 0; Part Number: 0603YC105KAT2A; Value: 1 uF; Tolerance: 10%; Composition: X7R; Created On: 26/07/2020 17:38:43; Updated On: 26/07/2020 17:39:03; Package: 0603 (1608 Metric)
C14 = GRM188Z71A475ME15D: MLCC Ceramic 4.7 uF 10 V 20% Capacitor; Manufacturer: Murata; Voltage: 10 V; Type: capacitor_ceramic; Through Hole: 0; Part Number: GRM188Z71A475ME15D; Value: 4.7 uF; Tolerance: 20%; Composition: X7R; Created On: 26/07/2020 16:11:28; Updated On: 26/07/2020 16:12:07; Package: 0603 (1608 Metric)
FB3 = BLM21SP601SH1D: Ferrite bead; Manufacturer: Murata Electronics; Number of Lines: 1; DC Resistance: 60 mOhms; Impedance Frequency: 600 Ohms @ 100 MHz; Current Rating: 1.5 A; Type: ferrite_bead; Through Hole: 0; Part Number: BLM21SP601SH1D; Value: 600 Ohms; Created On: 16/05/2020 11:32:40; Updated On: 16/05/2020 17:15:58; Package: 0805 (2012 Metric)
J2 = SHF-105-01-L-D-TH: Shrouded Terminal Strip, 0.050 pitch; Manufacturer: Samtec; Pitch: 50 mil; Voltage Rating: 300 V; Current Rating: 1 A; Number of Contacts: 10; Through Hole: 1; Part Number: SHF-105-01-L-D-TH; Orientation: straight; Number of Rows: 2; Created On: 31/05/2020 10:51:13; Updated On: 31/05/2020 10:51:32; Type: connector_pcb; Package: Through Hole
R13 R14 = CRCW060310K0FKEAC: Thin Film Resistor 10 kOhms 1%; Manufacturer: Vishay / Dale; Power Max: 100 mW; Through Hole: 0; Part Number: CRCW060310K0FKEAC; Value: 10 kOhms; Tolerance: 1%; Created On: 22/07/2020 22:08:22; Updated On: 22/07/2020 22:09:01; Type: resistor; Package: 0603 (1608 Metric)
U4 = STM32G431KBT6: STM32G431 ARM Cortex-M4  170MHz MCU; Manufacturer: STMicroelectronics; Core Size: 32 bits; Flash Size: 128 kB; RAM Size: 32 kB; Peripherals: ADC, DAC, Comparator, PGA, Temp, Timers; Connectivity: SPI, I2C, USART, USB, CAN, I2S; Voltage Supply: 3.3 V; Through Hole: 0; Part Number: STM32G431KBT6; Core: ARM Cortex-M4; Speed: 170 MHz; Created On: 22/05/2020 19:49:45; Updated On: 22/05/2020 19:55:34; Type: microcontroller; Package: LQFP32
Y1 = ABM8W-24.0000MHZ-8-B1U-T3: 24MHz 8pF -20C +70C 20ppm Crystal Oscillator; Manufacturer: ABRACON; Frquency Tolerance: 10 ppm; Through Hole: 0; Part Number: ABM8W-24.0000MHZ-8-B1U-T3; Value: 24 MHz; Load Capacitance: 8 pF; Frequency: 24 MHz; Created On: 24/05/2020 8:58:56; Updated On: 26/05/2020 19:01:38; Type: crystal_oscillator; Package: 4-SMD, No Lead

## Sheet Peripherals.SchDoc
size A4
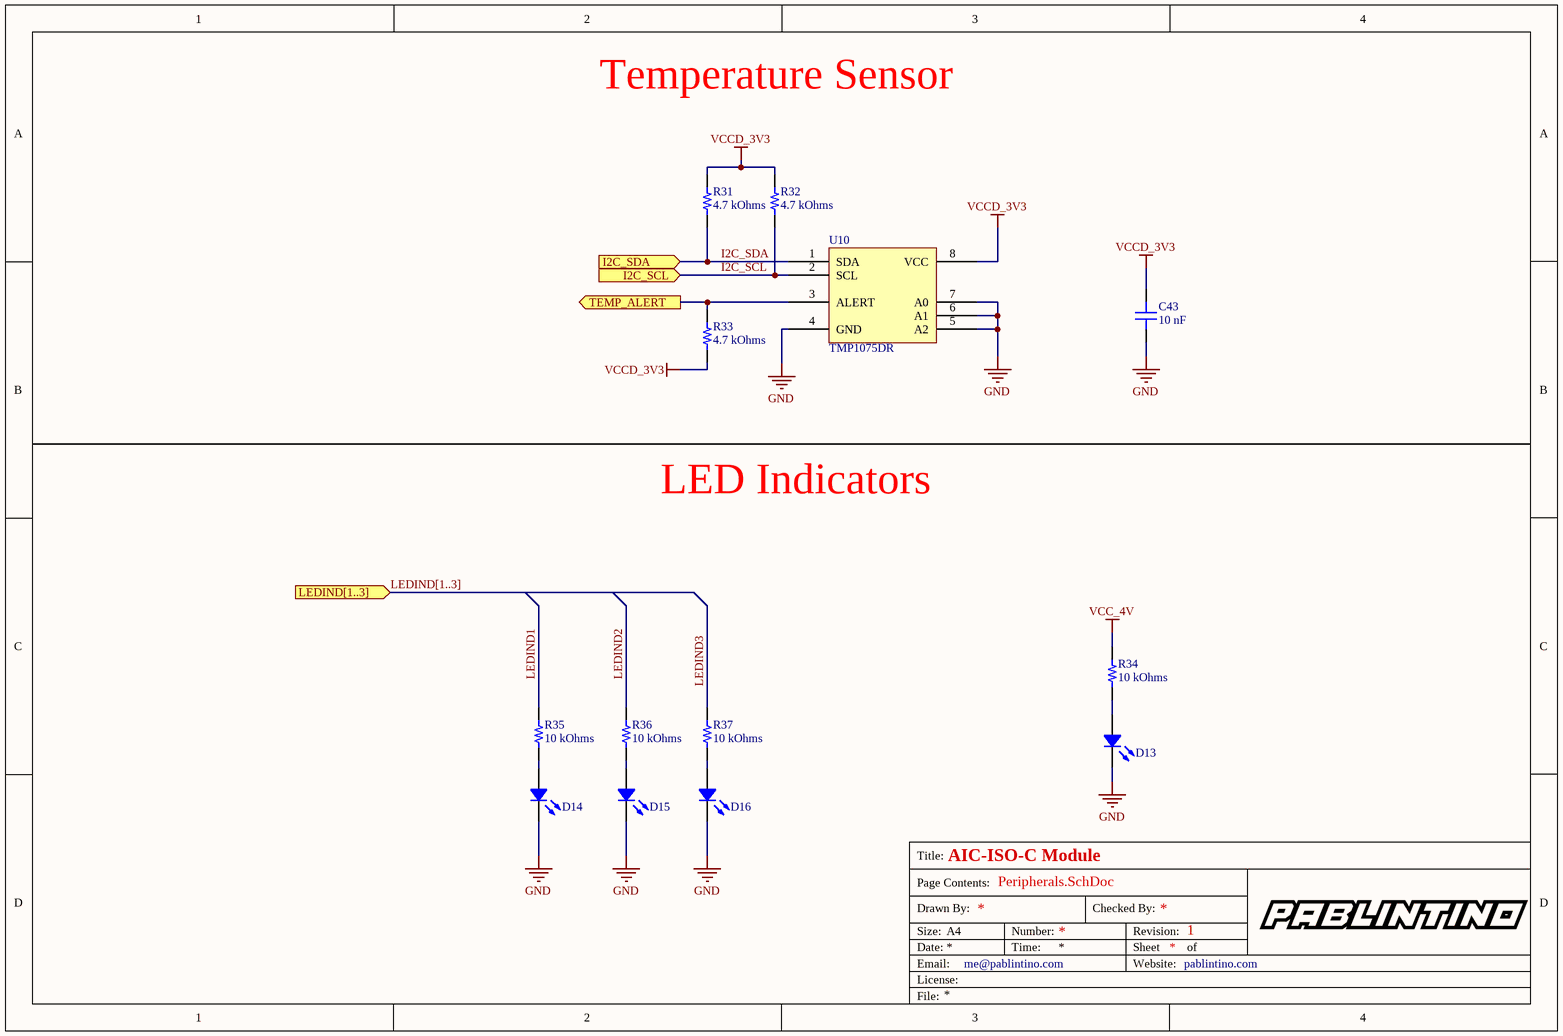
[diagram p5: Peripherals.SchDoc]

### Parts
C43  10 nF  [CAP 0805_2012]
D13  APTD1608LSECK  [LED 0603_1608 RED]  (value not drawn)
D14  APTD1608LZGCK  [LED 0603_1608 GREEN]  (value not drawn)
D15  APTD1608LZGCK  [LED 0603_1608 GREEN]  (value not drawn)
D16  APTD1608LSECK  [LED 0603_1608 RED]  (value not drawn)
R31  4.7 kOhms  [RES 0603_1608]
R32  4.7 kOhms  [RES 0603_1608]
R33  4.7 kOhms  [RES 0603_1608]
R34  10 kOhms  [RES 0603_1608]
R35  10 kOhms  [RES 0603_1608]
R36  10 kOhms  [RES 0603_1608]
R37  10 kOhms  [RES 0603_1608]
U10  TMP1075DR  [SOIC_DDAR_TEX]

### Ports
I2C_SCL (in), I2C_SDA (in), LEDIND[1..3] (in), TEMP_ALERT (out)

### Nets
GND: C43.2 D13.2 D14.2 D15.2 D16.2 U10.4(GND) U10.5(A2) U10.6(A1) U10.7(A0)
VCC_4V: R34.1
VCCD_3V3: C43.1 R31.2 R32.2 R33.1 U10.8(VCC)
I2C_SCL: R32.1 U10.2(SCL) ; port I2C_SCL
I2C_SDA: R31.1 U10.1(SDA) ; port I2C_SDA
LEDIND1: R35.1
LEDIND2: R36.1
LEDIND3: R37.1
NetD13_1: D13.1 R34.2
NetD14_1: D14.1 R35.2
NetD15_1: D15.1 R36.2
NetD16_1: D16.1 R37.2
NetR33_2: R33.2 U10.3(ALERT) ; port TEMP_ALERT

### Buses and harness runs
bus LEDIND[1..3] = port LEDIND[1..3]

### Notes on the sheet
- Temperature Sensor
- LED Indicators
- Title:
- Drawn By:
- Page Contents:
- Checked By:
- Size:
- Date:
- File:
- License:
- Email:
- A4
- Number:
- Time:
- Revision:
- Sheet
- Website:
- of

### Library data of the parts
C43 = C0805C103K5GEC7210: MLCC Ceramic 10 nF 50 V 10% Capacitor; Manufacturer: KEMET; Voltage: 50 V; Type: capacitor_ceramic; Through Hole: 0; Part Number: C0805C103K5GEC7210; Value: 10 nF; Tolerance: 10%; Composition: NP0; Created On: 28/05/2020 20:55:06; Updated On: 28/05/2020 20:58:59; Package: 0805 (2012 Metric)
D13 D16 = APTD1608LSECK: SMD Low Current Red LED; Manufacturer: Kingbright; Gain Bandwith Product: 1.8 V; Input Type: dome; Amplifier Type: clear; Slew Rate: 625 nm; Voltage Supplies: 2 mA; Input Offset Voltage: 0.8 mm x 1.2 mm; Type: led_indicator; Through Hole: 0; Part Number: APTD1608LSECK; Output Type: red; Created On: 28/07/2020 18:43:03; Updated On: 28/07/2020 18:43:38; Package: 0603 (1608 Metric)
D14 D15 = APTD1608LZGCK: SMD Low Current Green LED; Manufacturer: Kingbright; Gain Bandwith Product: 2.65 V; Input Type: dome; Amplifier Type: clear; Slew Rate: 515 nm; Voltage Supplies: 2 mA; Input Offset Voltage: 0.8 mm x 1.2 mm; Type: led_indicator; Through Hole: 0; Part Number: APTD1608LZGCK; Output Type: green; Created On: 28/07/2020 18:40:12; Updated On: 28/07/2020 18:43:35; Package: 0603 (1608 Metric)
R31-R33 = CRCW06034K70FKEAC: Thin Film Resistor 4.7 kOhms 1%; Manufacturer: Vishay / Dale; Power Max: 100 mW; Through Hole: 0; Part Number: CRCW06034K70FKEAC; Value: 4.7 kOhms; Tolerance: 1%; Created On: 28/07/2020 21:42:19; Updated On: 28/07/2020 21:42:52; Type: resistor; Package: 0603 (1608 Metric)
R34-R37 = CRCW060310K0FKEAC: as R13 on sheet CPU; Part Number: CRCW060310K0FKEAC; Value: 10 kOhms; Tolerance: 1%; Created On: 22/07/2020 22:08:22; Updated On: 22/07/2020 22:09:01; Type: resistor; Package: 0603 (1608 Metric)
U10 = TMP1075DR: TMP1075 Temperature Sensor With I2C and SMBus Interface; Part Number: TMP1075DR

## Sheet AnalogReceiverModule.SchDoc: CAN Current Loop Module - Analog Receiver
size A4; Author: Pablo R Nava; DrawnBy: Pablo R Nava; Engineer: Pablo R Nava
Used 4 times, as channels ARM1, ARM2, ARM3, ARM4. Parts and nets are listed once, with the designators drawn on the sheet.
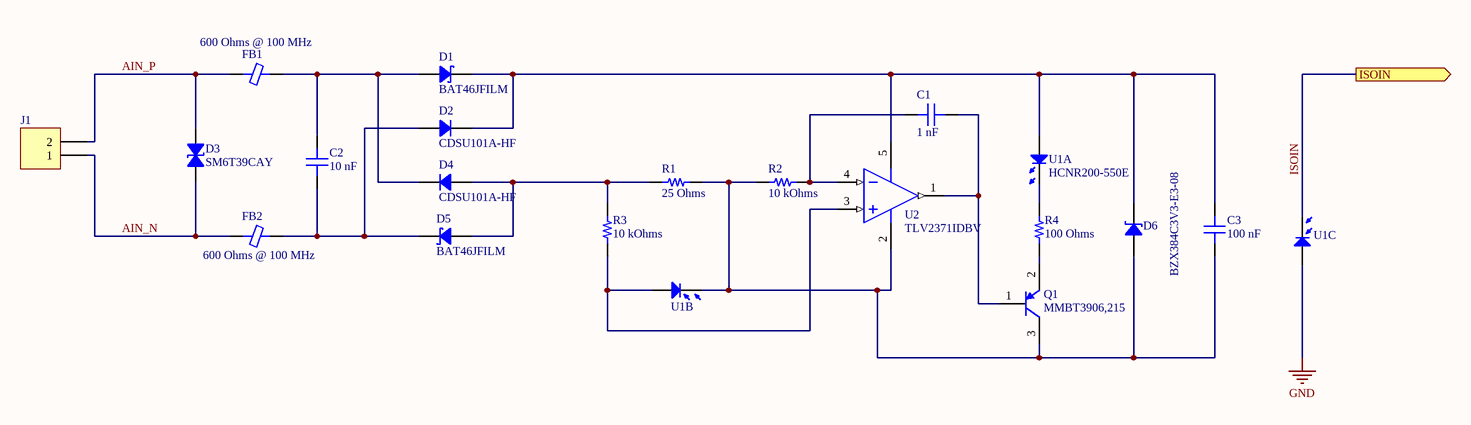
[diagram p6: AnalogReceiverModule.SchDoc]

### Parts
C1  1 nF  [CAP 0805_2012]
C2  10 nF  [CAP 0805_2012]
C3  100 nF  [CAP 0805_2012]
D1  BAT46JFILM  [SOD323]
D2  CDSU101A-HF  [SOD523F]
D3  SM6T39CAY  [DO214AA SMB]
D4  CDSU101A-HF  [SOD523F]
D5  BAT46JFILM  [SOD323]
D6  BZX384C3V3-E3-08  [SOD323]
FB1  600 Ohms @ 100 MHz  [FER 0805_2012]
FB2  600 Ohms @ 100 MHz  [FER 0805_2012]
J1  1757475  [MSTBA2]  (value not drawn)
Q1  MMBT3906,215  [NEXPERIA SOT-23-3]
R1  25 Ohms  [RES 0805_2012]
R2  10 kOhms  [RES 0805_2012]
R3  10 kOhms  [RES 0805_2012]
R4  100 Ohms  [RES 0805_2012]
U1  HCNR200-550E  [HCNR200]  (parts A,B,C of 3)
U2  TLV2371IDBV  [TI SOT-23-5 DBV]

### Ports
ISOIN (out)

### Nets
GND: U1.5(PD2_B)
AIN_N: D3.2 FB2.2 J1.1
AIN_P: D3.1 FB1.1 J1.2
ISOIN: U1.6(PD2_A) ; port ISOIN
NetC1_1: C1.1 Q1.1(B) U2.1(OUT)
NetC1_2: C1.2 R2.1 U2.4(IN-)
NetC2_1: C2.1 D2.1 D5.2 FB2.1
NetC2_2: C2.2 D1.1 D4.2 FB1.2
NetC3_1: C3.1 D6.1 Q1.3(C) R1.2 R2.2 U1.3(PD1_A) U2.2(GND)
NetC3_2: C3.2 D1.2 D2.2 D6.2 U1.2(LED_2) U2.5(VDD)
NetD4_1: D4.1 D5.1 R1.1 R3.1
NetQ1_2: Q1.2(E) R4.2
NetR3_2: R3.2 U1.4(PD1_B) U2.3(IN+)
NetR4_1: R4.1 U1.1(LED_1)

### Channels
ARM1: designators end in C1; ports ISOIN=ISOIN
ARM2: designators end in C2; ports ISOIN=ISOIN
ARM3: designators end in C3; ports ISOIN=ISOIN
ARM4: designators end in C4; ports ISOIN=ISOIN

### Notes on the sheet
- Title:
- Drawn By:
- Page Contents:
- Checked By:
- Size:
- Date:
- File:
- License:
- Email:
- A4
- Number:
- Time:
- Revision:
- Sheet
- Website:
- of

### Library data of the parts
C1 = C0805C102J2GECAUTO: MLCC Ceramic 1 nF 200 V 5% Capacitor; Manufacturer: KEMET; Voltage: 200 V; Type: capacitor_ceramic; Through Hole: 0; Part Number: C0805C102J2GECAUTO; Value: 1 nF; Tolerance: 5%; Composition: NP0; Created On: 30/05/2020 9:42:16; Updated On: 30/05/2020 9:42:22; Package: 0805 (2012 Metric)
C2 = C0805C103K5GEC7210: as C43 on sheet Peripherals; Part Number: C0805C103K5GEC7210; Value: 10 nF; Tolerance: 10%; Composition: NP0; Created On: 28/05/2020 20:55:06; Updated On: 28/05/2020 20:58:59; Package: 0805 (2012 Metric)
C3 = 08055C104K4Z2A: MLCC Ceramic 100 nF 50 V 10% Capacitor; Manufacturer: AVX; Voltage: 50 V; Type: capacitor_ceramic; Through Hole: 0; Part Number: 08055C104K4Z2A; Value: 100 nF; Tolerance: 10%; Composition: X7R; Created On: 30/05/2020 9:36:24; Updated On: 30/05/2020 9:36:39; Package: 0805 (2012 Metric)
D1 D5 = BAT46JFILM: Schottky Diode; Manufacturer: STMicroelectronics; Forward Voltage: 0.45 V; Reverse Leakage Current: 5 uA; Maximum Forward Avg. Current: 150 mA; Maximum Repetitive Reverse Voltage: 100 V; Type: diode_rectifier; Through Hole: 0; Part Number: BAT46JFILM; Diode Type: schottky; Created On: 16/05/2020 11:52:41; Updated On: 16/05/2020 14:59:23; Package: SOD-323
D2 D4 = CDSU101A-HF: General Purpose Diode; Manufacturer: Comchip Technology; Forward Voltage: 1 V; Reverse Leakage Current: 50 nA; Maximum Forward Avg. Current: 100 mA; Maximum Repetitive Reverse Voltage: 90 V; Diode Type: rectifier; Type: diode_rectifier; Through Hole: 0; Part Number: CDSU101A-HF; Created On: 16/05/2020 11:56:11; Updated On: 16/05/2020 15:37:54; Package: SOD-523F
D3 = SM6T39CAY: TVS Diode; Manufacturer: STMicroelectronics; Standoff Reverse Voltage: 33.3 V; Minimum Breakdown Voltage: 39 V; Maximum Clamping Voltage: 53.9 V; Type: diode_tvs; Through Hole: 0; Part Number: SM6T39CAY; Created On: 16/05/2020 11:52:32; Updated On: 16/05/2020 15:46:11; Package: DO-214AA-2
D6 = BZX384C3V3-E3-08: Zener Diode 3.3 V 200 mW; Manufacturer: Vishay; Tolerance: 5%; Maximum Power: 200 mW; Forward Voltage: 0.6 V; Zener Voltage: 3.3 nA; Type: diode_zener; Through Hole: 0; Part Number: BZX384C3V3-E3-08; Created On: 16/05/2020 22:26:20; Updated On: 16/05/2020 22:36:30; Package: SOD-323-2
FB1 FB2 = BLM21SP601SH1D: Ferrite bead; Manufacturer: Murata Electronics; Number of Lines: 1; DC Resistance: 60 mOhms; Current Rating: 1.5 A; Type: ferrite_bead; Through Hole: 0; Part Number: BLM21SP601SH1D; Value: 600 Ohms @ 100 MHz; Impedance Frequency: 600 Ohms @ 100 MHz; Created On: 16/05/2020 11:32:40; Updated On: 16/05/2020 17:15:58; Package: 0805 (2012 Metric)
J1 = 1757475: Pluggable Terminal Blocks 2 Pos 5mm pitch Through Hole Header; Manufacturer: Phoenix Contact; Voltage Rating: 250 V; Current Rating: 12 A; Number of Contacts: 2; Through Hole: 1; LatestRevisionDate: 17-Jul-2002; LatestRevisionNote: Re-released for DXP Platform.; Publisher: Altium Limited; Part Number: 1757475; Orientation: right; Pitch: 5 mm; Number of Rows: 1; Created On: 18/07/2020 15:45:14; Updated On: 18/07/2020 15:45:51; Type: connector_pcb; Package: Through Hole
Q1 = MMBT3906,215: PNP BJT Switching transistor; Manufacturer: Nexperia; Collector Emiter Saturation Voltage: 250 mW; hfe Gain: 300; Collector Emiter Max. Votage: 40 V; Collector Max. Current: 200 mA; Type: transistor_bjt; Through Hole: 0; Part Number: MMBT3906,215; Maximum Power: 250 mW; BJT Type: PNP; Created On: 17/05/2020 17:12:55; Updated On: 17/05/2020 18:19:58; Package: SOT-23
R1 = PAT0805E25R0BST1: Thin Film Resistor 25 Ohms 0.1%; Manufacturer: Vishay; Power Max: 200 mW; Through Hole: 0; Part Number: PAT0805E25R0BST1; Value: 25 Ohms; Tolerance: 0.1%; Created On: 16/05/2020 11:40:45; Updated On: 16/05/2020 13:13:11; Type: resistor; Package: 0805 (2012 Metric)
R2 R3 = CRCW080510K0FKEAC: Thin Film Resistor 10 kOhms 1%; Manufacturer: Vishay / Dale; Power Max: 125 mW; Through Hole: 0; Part Number: CRCW080510K0FKEAC; Value: 10 kOhms; Tolerance: 1%; Created On: 16/05/2020 11:50:43; Updated On: 16/05/2020 13:13:15; Type: resistor; Package: 0805 (2012 Metric)
R4 = CRCW0805100RFKEAC: as R15 on sheet PowerModule; Part Number: CRCW0805100RFKEAC; Value: 100 Ohms; Tolerance: 1%; Created On: 16/05/2020 11:51:25; Updated On: 16/05/2020 13:13:19; Type: resistor; Package: 0805 (2012 Metric)
U1 = HCNR200-550E: HCNR200 High-Linearity Analog Optocoupler; Manufacturer: Broadcom / Avago; Isolation Voltage: 1414 V; Transfer Gain: 1.00; Input FOrward Voltage: 1.6 V; Servo Gain: 0.5; Non Linearity: 0.01%; Through Hole: 0; Part Number: HCNR200-550E; Forward Gain: 0.5; Created On: 17/05/2020 9:43:12; Updated On: 17/05/2020 9:47:26; Type: optocoupler_linear; Package: DIP-8 Gull Wing
U2 = TLV2371IDBV: TLV2371 Rail-to-Rail I/O Opamp; Manufacturer: Texas Instruments; Gain Bandwith Product: 3 MHz; Amplifier Type: 125 mW; Slew Rate: 2.4 V/us; Voltage Supplies: 2.7-16 V; Input Offset Voltage: 2 mV; Output Current: 100 mA; Through Hole: 0; Part Number: TLV2371IDBV; Output Type: Rail-to-Rail; Input Type: Rail-to-Rail; Created On: 17/05/2020 15:21:19; Updated On: 17/05/2020 15:21:42; Type: opamp; Package: SOT-23-5

## Nets that join several sheets
GND: PowerModule (10 pins), AnalogueIsolatedReceiver (6 pins), CanTransceiver (5 pins), CPU (17 pins), Peripherals (9 pins), ARM1 (U1C1.5), ARM2 (U1C2.5), ARM3 (U1C3.5), ARM4 (U1C4.5)
GND_ISO: PowerModule (17 pins), CanTransceiver (12 pins)
V_5V5_ISO: PowerModule (C30.1 C32.2 L2.2 R24.1), CanTransceiver (5 pins)
VCC_4V: PowerModule (10 pins), Peripherals (R34.1)
VCCA_3V3: PowerModule (C25.1 U6.5), AnalogueIsolatedReceiver (C4.2 U3.4), CPU (C11.1 FB3.2)
VCCD_3V3: PowerModule (C28.1 U7.5), CanTransceiver (C34.1 C35.2 C36.1 U9.1), CPU (8 pins), Peripherals (5 pins)
VIN_24: PowerModule (IC1.2 IC1.4), CanTransceiver (J3.4)
AICHN1: AnalogueIsolatedReceiver (C5.2 R6.2 R6.3 U3.1), CPU (U4.8)
AICHN2: AnalogueIsolatedReceiver (C6.2 R8.2 R8.3 U3.7), CPU (U4.7)
AICHN3: AnalogueIsolatedReceiver (C7.2 R10.2 R10.3 U3.8), CPU (U4.6)
AICHN4: AnalogueIsolatedReceiver (C8.2 R12.2 R12.3 U3.14), CPU (U4.5)
I2C_SCL: CPU (U4.18), Peripherals (R32.1 U10.2)
I2C_SDA: CPU (U4.28), Peripherals (R31.1 U10.1)
ISOIN: AnalogueIsolatedReceiver (C5.1 R5.2 U3.2), ARM1 (U1C1.6)
ISOIN: AnalogueIsolatedReceiver (C6.1 R7.2 U3.6), ARM2 (U1C2.6)
ISOIN: AnalogueIsolatedReceiver (C7.1 R9.2 U3.9), ARM3 (U1C3.6)
ISOIN: AnalogueIsolatedReceiver (C8.1 R11.2 U3.13), ARM4 (U1C4.6)
LEDIND1: CPU (U4.9), Peripherals (R35.1)
LEDIND2: CPU (U4.10), Peripherals (R36.1)
LEDIND3: CPU (U4.11), Peripherals (R37.1)
NetR33_2: CPU (U4.12), Peripherals (R33.2 U10.3)
NetU4_21: CanTransceiver (U9.5), CPU (U4.21)
NetU4_22: CanTransceiver (U9.3), CPU (U4.22)